# Altium project PX4FMUv2.3.PrjPcb
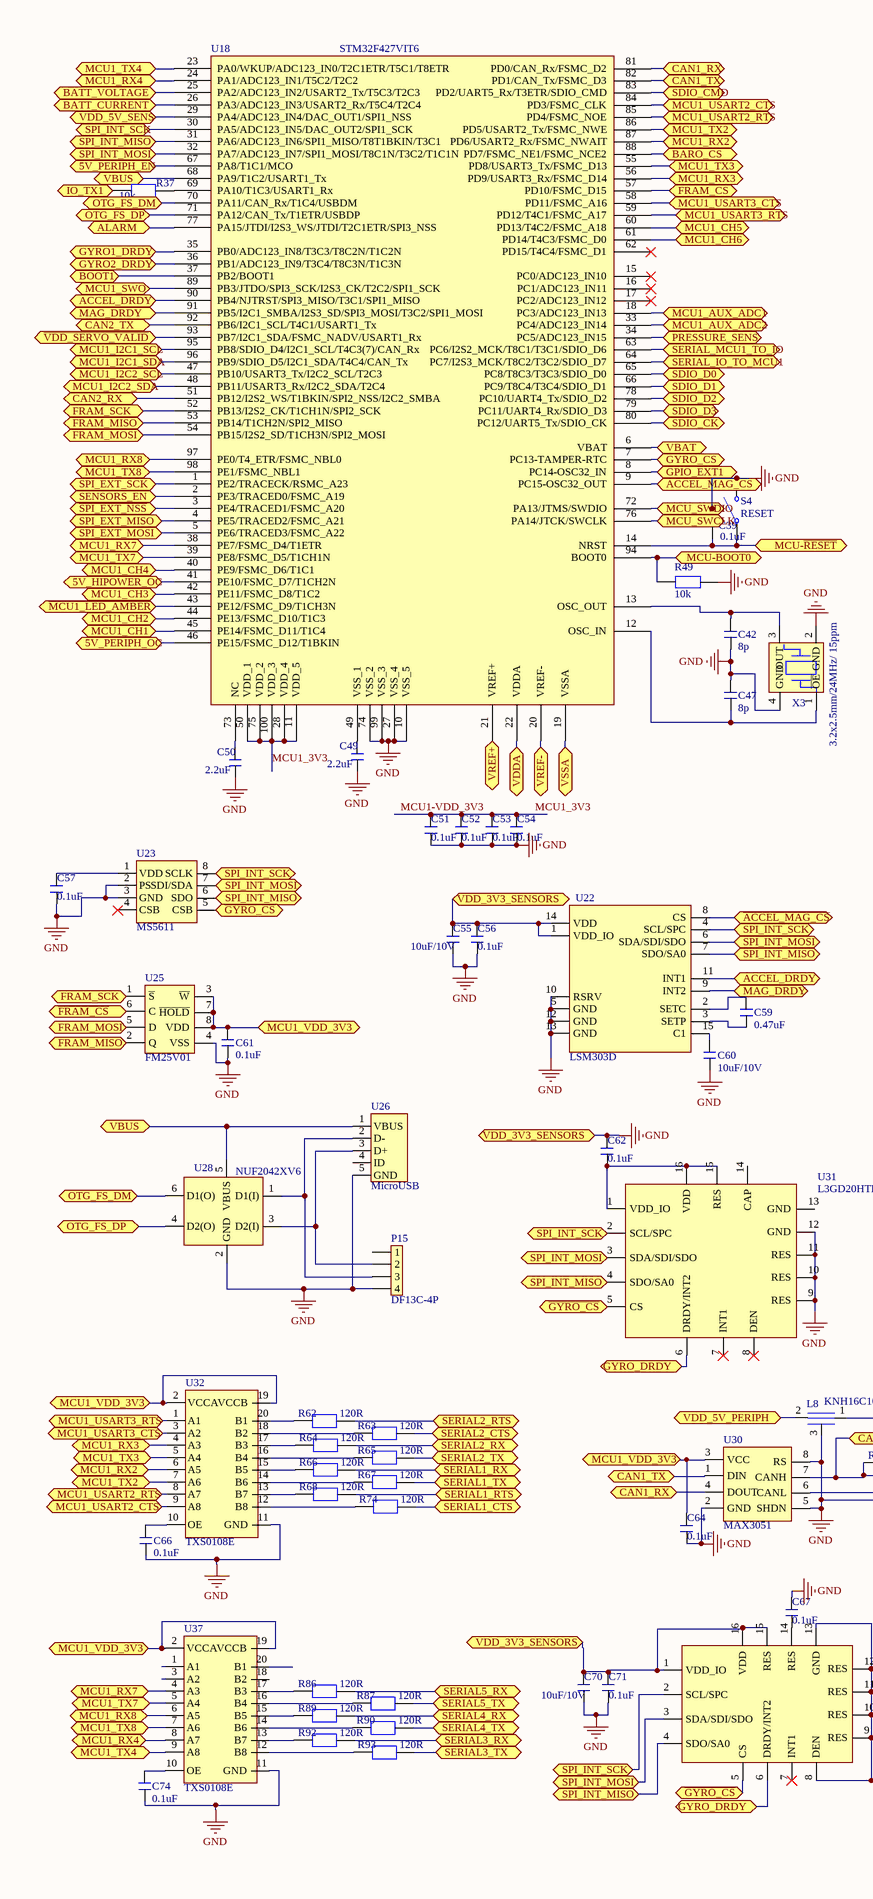
[diagram p0: PX4FMUV2.3_SCH_PROJECT.SchDoc, left]
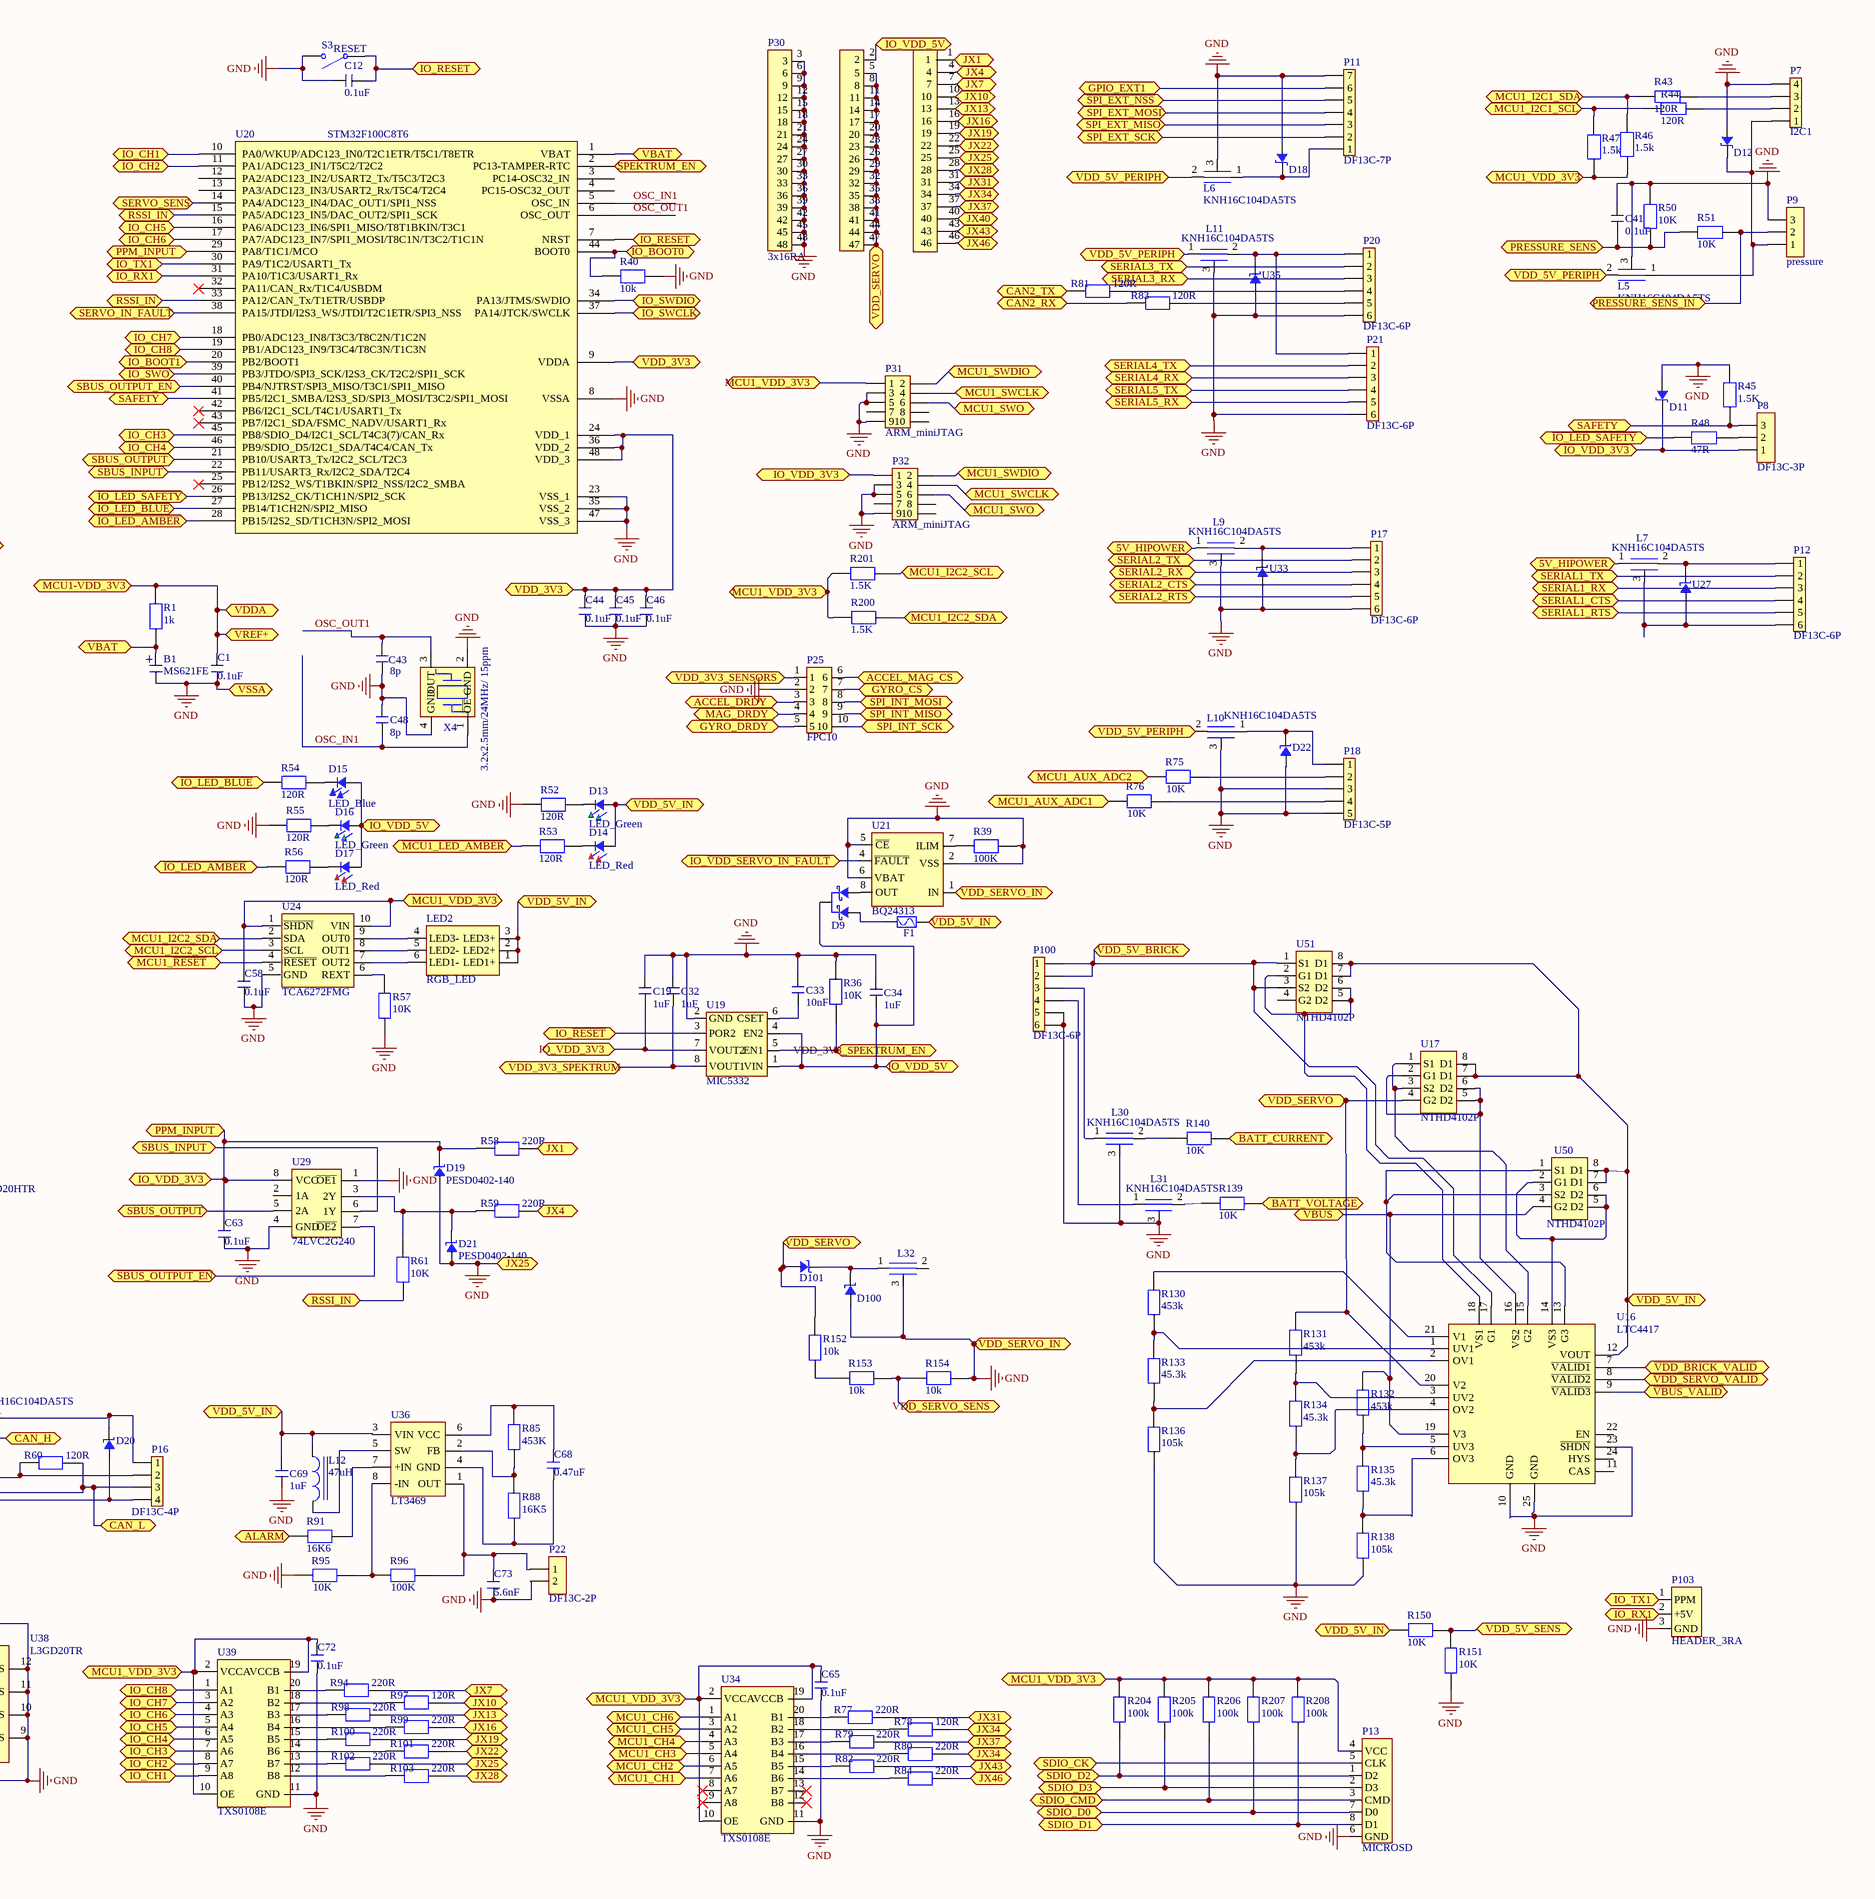
[diagram p1: PX4FMUV2.3_SCH_PROJECT.SchDoc, right]
1 sheet, 203 parts. Net scope: flat (ports and power ports of the same name join across sheets).

## Sheet PX4FMUV2.3_SCH_PROJECT.SchDoc
size A2

### Parts
B1  MS621FE  [MS621FE]
C1  0.1uF  [C 0402]
C12  0.1uF  [C 0402]
C19  1uF  [C 0603_L]
C32  1uF  [C 0603_L]
C33  10nF  [C 0402]
C34  1uF  [C 0603_L]
C39  0.1uF  [C 0402]
C41  0.1uF  [C 0402]
C42  8p  [C 0402]
C43  8p  [C 0402]
C44  0.1uF  [C 0402]
C45  0.1uF  [C 0402]
C46  0.1uF  [C 0402]
C47  8p  [C 0402]
C48  8p  [C 0402]
C49  2.2uF  [C 0603_L]
C50  2.2uF  [C 0603_L]
C51  0.1uF  [C 0402]
C52  0.1uF  [C 0402]
C53  0.1uF  [C 0402]
C54  0.1uF  [C 0402]
C55  10uF/10V  [C 0805_L]
C56  0.1uF  [C 0402]
C57  0.1uF  [C 0402]
C58  0.1uF  [C 0402]
C59  0.47uF  [C 0402]
C60  10uF/10V  [C 0805_L]
C61  0.1uF  [C 0402]
C62  0.1uF  [C 0402]
C63  0.1uF  [C 0402]
C64  0.1uF  [C 0402]
C65  0.1uF  [C 0402]
C66  0.1uF  [C 0402]
C67  0.1uF  [C 0402]
C68  0.47uF  [C 0402]
C69  1uF  [C 0603_L]
C70  10uF/10V  [C 0805_L]
C71  0.1uF  [C 0402]
C72  0.1uF  [C 0402]
C73  5.6nF  [C 0402]
C74  0.1uF  [C 0402]
D9  PMEG2005CT  [SOT23]  (value not drawn)
D11  PESD0402-140  [0402-TVS]  (value not drawn)
D12  PESD0402-140  [0402-TVS]  (value not drawn)
D13  LED_Green  [LED 0603G]
D14  LED_Red  [LED 0603R]
D15  LED_Blue  [LED 0603B]
D16  LED_Green  [LED 0603G]
D17  LED_Red  [LED 0603R]
D18  PESD0402-140  [0402-TVS]  (value not drawn)
D19  PESD0402-140  [0402-TVS]
D20  PESD0402-140  [0402-TVS]  (value not drawn)
D21  PESD0402-140  [0402-TVS]
D22  PESD0402-140  [0402-TVS]  (value not drawn)
D100  PESD0402-140  [0402-TVS]  (value not drawn)
D101  PESD0402-140  [0402-TVS]  (value not drawn)
F1  0ZCA0035FF2G  [PTC-1206]  (value not drawn)
L5  KNH16C104DA5TS  [KYOCERA-KNH16-DA]
L6  KNH16C104DA5TS  [KYOCERA-KNH16-DA]
L7  KNH16C104DA5TS  [KYOCERA-KNH16-DA]
L8  KNH16C104DA5TS  [KYOCERA-KNH16-DA]
L9  KNH16C104DA5TS  [KYOCERA-KNH16-DA]
L10  KNH16C104DA5TS  [KYOCERA-KNH16-DA]
L11  KNH16C104DA5TS  [KYOCERA-KNH16-DA]
L12  47uH  [L 0805]
L30  KNH16C104DA5TS  [KYOCERA-KNH16-DA]
L31  KNH16C104DA5TS  [KYOCERA-KNH16-DA]
L32  KNH16C104DA5TS  [KYOCERA-KNH16-DA]  (value not drawn)
LED2  RGB_LED  [RGB_LED]
P7  I2C1  [MX 1.25-LS-4P]
P8  DF13C-3P  [MX 1.25-LS-3P]
P9  pressure  [MX 1.25-LS-3P]
P11  DF13C-7P  [MX 1.25-LS-7P]
P12  DF13C-6P  [MX 1.25-LS-6P]
P13  MICROSD  [microSD]
P15  DF13C-4P  [MX 1.25-LS-4P]
P16  DF13C-4P  [MX 1.25-LS-4P]
P17  DF13C-6P  [MX 1.25-LS-6P]
P18  DF13C-5P  [MX 1.25-LS-5P]
P20  DF13C-6P  [MX 1.25-LS-6P]
P21  DF13C-6P  [MX 1.25-LS-6P]
P22  DF13C-2P  [MX 1.25-LS-2P]
P25  FPC10  [FPC0.5 2H-WS-10P]
P30  3x16RA  [3x16RA]
P31  ARM_miniJTAG  [FTSH-105-01-XXX-DV-K]
P32  ARM_miniJTAG  [FTSH-105-01-XXX-DV-K]
P100  DF13C-6P  [MX 1.25-LS-6P]
P103  HEADER_3RA
R1  1k  [0402R]
R36  10K  [0402R]
R37  10k  [0402R]
R39  100K  [0402R]
R40  10k  [0402R]
R43  120R  [0402R]
R44  120R  [0402R]
R45  1.5K  [0402R]
R46  1.5k  [0402R]
R47  1.5k  [0402R]
R48  47R  [0402R]
R49  10k  [0402R]
R50  10K  [0402R]
R51  10K  [0402R]
R52  120R  [0402R]
R53  120R  [0402R]
R54  120R  [0402R]
R55  120R  [0402R]
R56  120R  [0402R]
R57  10K  [0402R]
R58  220R  [0402R]
R59  220R  [0402R]
R60  120R  [0402R]
R61  10K  [0402R]
R62  120R  [0402R]
R63  120R  [0402R]
R64  120R  [0402R]
R65  120R  [0402R]
R66  120R  [0402R]
R67  120R  [0402R]
R68  120R  [0402R]
R74  120R  [0402R]
R75  10K  [0402R]
R76  10K  [0402R]
R77  220R  [0402R]
R78  120R  [0402R]
R79  220R  [0402R]
R80  220R  [0402R]
R81  120R  [0402R]
R82  220R  [0402R]
R83  120R  [0402R]
R84  220R  [0402R]
R85  453K  [0402R]
R86  120R  [0402R]
R87  120R  [0402R]
R88  16K5  [0402R]
R89  120R  [0402R]
R90  120R  [0402R]
R91  16K6  [0402R]
R92  120R  [0402R]
R93  120R  [0402R]
R94  220R  [0402R]
R95  10K  [0402R]
R96  100K  [0402R]
R97  120R  [0402R]
R98  220R  [0402R]
R99  220R  [0402R]
R100  220R  [0402R]
R101  220R  [0402R]
R102  220R  [0402R]
R103  220R  [0402R]
R130  453k  [0402R]
R131  453k  [0402R]
R132  453k  [0402R]
R133  45.3k  [0402R]
R134  45.3k  [0402R]
R135  45.3k  [0402R]
R136  105k  [0402R]
R137  105k  [0402R]
R138  105k  [0402R]
R139  10K  [0402R]
R140  10K  [0402R]
R150  10K  [0402R]
R151  10K  [0402R]
R152  10k  [0402R]
R153  10k  [0402R]
R154  10k  [0402R]
R200  1.5K  [0402R]
R201  1.5K  [0402R]
R204  100k  [0402R]
R205  100k  [0402R]
R206  100k  [0402R]
R207  100k  [0402R]
R208  100k  [0402R]
S3  RESET  [EVQP7J01K]
S4  RESET  [EVQP7J01K]
U16  LTC4417  [MO-220]
U17  NTHD4102P  [1206-8]
U18  STM32F427VIT6  [LQPF_100]
U19  MIC5332  [QFN8]
U20  STM32F100C8T6  [LQFP_48]
U21  BQ24313  [QFN8]
U22  LSM303D  [LGA_16L]
U23  MS5611  [MS5611]
U24  TCA6272FMG  [SON10]
U25  FM25V01  [SOIC8]
U26  MicroUSB  [USB-MICRO_E]
U27  PESD0402-140  [0402-TVS]  (value not drawn)
U28  NUF2042XV6  [SOT563-6]
U29  74LVC2G240  [TSSOP-8]
U30  MAX3051  [SOT23-8]
U31  L3GD20HTR  [LGA_16L]
U32  TXS0108E  [PQFN50P450X350X100_HS-21N]
U33  PESD0402-140  [0402-TVS]  (value not drawn)
U34  TXS0108E  [PQFN50P450X350X100_HS-21N]
U35  PESD0402-140  [0402-TVS]  (value not drawn)
U36  LT3469  [SOT23-8]
U37  TXS0108E  [PQFN50P450X350X100_HS-21N]
U38  L3GD20TR  [LGA-16]
U39  TXS0108E  [PQFN50P450X350X100_HS-21N]
U50  NTHD4102P  [1206-8]
U51  NTHD4102P  [1206-8]
X3  3.2x2.5mm/24MHz/ 15ppm  [OSC 3225-4P]
X4  3.2x2.5mm/24MHz/ 15ppm  [OSC 3225-4P]

### Ports
5V_HIPOWER (bidir), 5V_HIPOWER_OC (bidir), 5V_PERIPH_EN (bidir), 5V_PERIPH_OC (bidir), ACCEL_DRDY (bidir), ACCEL_MAG_CS (bidir), ALARM (bidir), BARO_CS (bidir), BATT_CURRENT (bidir), BATT_VOLTAGE (bidir), BOOT1 (bidir), CAN1_RX (bidir), CAN1_TX (bidir), CAN2_RX (bidir), CAN2_TX (bidir), CAN_H (bidir), CAN_L (bidir), FRAM_CS (bidir), FRAM_MISO (bidir), FRAM_MOSI (bidir), FRAM_SCK (bidir), GPIO_EXT1 (bidir), GYRO1_DRDY (bidir), GYRO2_DRDY (bidir), GYRO_CS (bidir), GYRO_DRDY (bidir), IO_BOOT0 (bidir), IO_BOOT1 (bidir), IO_CH1 (bidir), IO_CH2 (bidir), IO_CH3 (bidir), IO_CH4 (bidir), IO_CH5 (bidir), IO_CH6 (bidir), IO_CH7 (bidir), IO_CH8 (bidir), IO_RESET (bidir), IO_RX1 (bidir), IO_SWCLK (bidir), IO_SWDIO (bidir), IO_SWO (bidir), IO_TX1 (bidir), IO_VDD_3V3 (bidir), IO_VDD_5V (bidir), IO_~{RESET} (bidir), IO_~{VDD_SERVO_IN_FAULT} (bidir), JX1 (bidir), JX4 (bidir), JX7 (bidir), JX10 (bidir), JX13 (bidir), JX16 (bidir), JX19 (bidir), JX22 (bidir), JX25 (bidir), JX28 (bidir), JX31 (bidir), JX34 (bidir), JX37 (bidir), JX40 (bidir), JX43 (bidir), JX46 (bidir), MAG_DRDY (bidir), MCU1-VDD_3V3 (bidir), MCU1_AUX_ADC1 (bidir), MCU1_AUX_ADC2 (bidir), MCU1_CH1 (bidir), MCU1_CH2 (bidir), MCU1_CH3 (bidir), MCU1_CH4 (bidir), MCU1_CH5 (bidir), MCU1_CH6 (bidir), MCU1_I2C1_SCL (bidir), MCU1_I2C1_SDA (bidir), MCU1_I2C2_SCL (bidir), MCU1_I2C2_SDA (bidir), MCU1_RX2 (bidir), MCU1_RX3 (bidir), MCU1_RX4 (bidir), MCU1_RX7 (bidir), MCU1_RX8 (bidir), MCU1_SWCLK (bidir), MCU1_SWDIO (bidir), MCU1_SWO (bidir), MCU1_TX2 (bidir), MCU1_TX3 (bidir), MCU1_TX4 (bidir), MCU1_TX7 (bidir), MCU1_TX8 (bidir), MCU1_USART2_CTS (bidir), MCU1_USART2_RTS (bidir), MCU1_USART3_CTS (bidir), MCU1_USART3_RTS (bidir), MCU1_VDD_3V3 (bidir), MCU1_~{RESET} (bidir), MCU-BOOT0 (bidir), MCU-~{RESET} (bidir), MCU_SWCLK (bidir), MCU_SWDIO (bidir), OTG_FS_DM (bidir), OTG_FS_DP (bidir), PPM_INPUT (bidir), PRESSURE_SENS (bidir), PRESSURE_SENS_IN (bidir), RSSI_IN (bidir), SAFETY (bidir), SBUS_INPUT (bidir), SBUS_OUTPUT (bidir), SBUS_OUTPUT_EN (bidir), SDIO_CK (bidir), SDIO_CMD (bidir), SDIO_D0 (bidir), SDIO_D1 (bidir), SDIO_D2 (bidir), SDIO_D3 (bidir), SENSORS_EN (bidir), SERIAL1_CTS (bidir), SERIAL1_RTS (bidir), SERIAL1_RX (bidir), SERIAL1_TX (bidir), SERIAL2_CTS (bidir), SERIAL2_RTS (bidir), SERIAL2_RX (bidir), SERIAL2_TX (bidir), SERIAL3_RX (bidir), SERIAL3_TX (bidir), SERIAL4_RX (bidir), SERIAL4_TX (bidir), SERIAL5_RX (bidir), SERIAL5_TX (bidir), SERIAL_IO_TO_MCU1 (bidir), SERIAL_MCU1_TO_IO (bidir), SERVO_IN_FAULT (bidir), SERVO_SENS (bidir), SPEKTRUM_EN (bidir), SPI_EXT_MISO (bidir), SPI_EXT_MOSI (bidir), SPI_EXT_SCK (bidir), SPI_INT_MISO (bidir), SPI_INT_MOSI (bidir), SPI_INT_SCK (bidir), VBAT (bidir), VBUS (bidir), VDD_3V3 (bidir), VDD_3V3_SENSORS (bidir), VDD_3V3_SPEKTRUM (bidir), VDD_3V3_SPEKTRUM_EN (bidir), VDD_5V_BRICK (bidir), VDD_5V_IN (bidir), VDD_5V_PERIPH (bidir), VDD_5V_SENS (bidir), VDD_SERVO (bidir), VDD_SERVO_IN (bidir), VDD_SERVO_SENS (bidir), VDDA (bidir), VREF+ (bidir), VREF- (bidir), VSSA (bidir), ~{ACCEL_MAG_CS} (bidir), ~{FRAM_CS} (bidir), ~{GYRO_CS} (bidir), ~{IO_LED_AMBER} (bidir), ~{IO_LED_BLUE} (bidir), ~{IO_LED_SAFETY} (bidir), ~{MCU1_LED_AMBER} (bidir), ~{SBUS_OUTPUT_EN} (bidir), ~{SPI_EXT_NSS} (bidir), ~{VBUS_VALID} (bidir), ~{VDD_BRICK_VALID} (bidir), ~{VDD_SERVO_VALID} (bidir)

### Nets
GND: B1.2 C1.2 C12.2 C19.2 C32.2 C33.2 C34.2 C39.2 C41.2 C42.2 C43.2 C44.2 C45.2 C46.2 C47.1 C48.1 C49.2 C50.2 C51.2 C52.2 C53.2 C54.2 C55.1 C55.2 C56.1 C56.2 C57.2 C58.2 C60.2 C61.2 C62.1 C63.2 C64.2 C65.2 C66.2 C67.1 C69.2 C70.1 C70.2 C71.1 C71.2 C72.2 C73.2 C74.2 D11.1 D12.1 D18.1 D19.1 D20.1 D21.1 D22.1 D100.1 L5.3 L6.3 L8.3 L9.3 L10.3 L11.3 L30.3 L31.3 L32.3 P7.4 P9.3 P11.7 P13.6(GND) P15.4 P16.4 P17.6 P18.3 P18.5 P20.6 P21.6 P22.2 P25.1 P25.2 P30.3 P30.6 P30.9 P30.12 P30.15 P30.18 P30.21 P30.24 P30.25 P30.27 P30.30 P30.33 P30.36 P30.39 P30.42 P30.45 P30.48 P31.3 P31.5 P31.9 P32.3 P32.5 P32.9 P100.5 P100.6 P103.3(GND) R36.2 R39.2 R40.1 R45.2 R49.1 R50.2 R52.1 R55.1 R57.1 R95.2 R102.2 R136.1 R137.1 R138.1 R151.2 R154.1 S3.2 S4.2 U16.10(GND) U16.23(~{SHDN}) U16.25(GND) U18.10(VSS_5) U18.19(VSSA) U18.27(VSS_4) U18.74(VSS_2) U18.99(VSS_3) U19.2(GND) U20.8(VSSA) U20.23(VSS_1) U20.35(VSS_2) U20.47(VSS_3) U21.1(IN) U21.2(VSS) U21.5(~{CE}) U21.6(VBAT) U22.1(VDD_IO) U22.5(GND) U22.10(RSRV) U22.12(GND) U22.13(GND) U22.14(VDD) U23.2(PS) U23.3(GND) U24.5(GND) U25.4(VSS) U26.5(GND) U28.2(GND) U29.1(~{OE1}) U29.4(GND) U30.2(GND) U30.5(SHDN) U30.8(RS) U31.9(RES) U31.10(RES) U31.11(RES) U31.12(GND) U32.11(GND) U33.1 U34.11(GND) U35.1 U37.11(GND) U38.1(VDD_IO) U38.8(DEN) U38.9(RES) U38.10(RES) U38.11(RES) U38.12(RES) U38.13(GND) U38.15(RES) U38.16(VDD) U39.11(GND) X3.2(GND) X3.4(GND) X4.2(GND) X4.4(GND) ; port VSSA, port VDD_3V3_SENSORS, port JX25, port VDD_SERVO_IN
MCU1-VDD_3V3: C51.1 C52.1 C53.1 C54.1 U18.11(VDD_5) U18.28(VDD_4) U18.50(VDD_1) U18.75(VDD_2) U18.100(VDD_3)  [also labelled MCU1_3V3]
OSC_IN1: C48.2 U20.5(OSC_IN) X4.1(~{OE})
OSC_OUT1: C43.1 U20.6(OSC_OUT) X4.3(OUT)
NetB1_1: B1.1 R1.1 U18.6(VBAT) U20.1(VBAT) ; port VBAT
NetC1_1: C1.1 R1.2 U18.21(VREF+) U18.22(VDDA) ; port VDDA, port VREF+, port MCU1-VDD_3V3
NetC12_1: C12.1 S3.1 U20.7(NRST) ; port IO_RESET
NetC19_1: C19.1 C63.1 D11.2 D19.2 P8.1 P32.1 R58.1 U19.7(VOUT2) U20.29(PA8/T1C1/MCO) U29.8(VCC) ; port PPM_INPUT, port IO_VDD_3V3
NetC32_1: C32.1 U19.8(VOUT1) ; port VDD_3V3_SPEKTRUM
NetC33_1: C33.1 U19.6(CSET)
NetC34_1: C34.1 D9.3 D15.3 D16.3 D17.3 P30.2 U19.1(VIN) U19.4(EN2) ; port IO_VDD_5V
NetC39_1: C39.1 S4.1 U18.14(NRST) ; port MCU-~{RESET}
NetC41_1: C41.1 R50.1 R51.1 U18.34(PC5/ADC123_IN15) ; port PRESSURE_SENS
NetC42_1: C42.1 U18.13(OSC_OUT) X3.3(OUT)
NetC44_1: C44.1 C45.1 C46.1 U20.9(VDDA) U20.24(VDD_1) U20.36(VDD_2) U20.48(VDD_3) ; port VDD_3V3
NetC47_2: C47.2 U18.12(OSC_IN) X3.1(~{OE})
NetC49_1: C49.1 U18.49(VSS_1)
NetC50_1: C50.1 U18.73(NC)
NetC57_1: C57.1 U23.1(VDD)
NetC58_1: C58.1 C61.1 C64.1 C65.1 C72.1 P13.4(VCC) P31.1 R46.2 R47.2 R200.2 R201.2 R204.2 R205.2 R206.2 R207.2 R208.2 U24.1(~{SHDN}) U24.10(VIN) U25.3(~{W}) U25.7(~{HOLD}) U25.8(VDD) U30.3(VCC) U32.2(VCCA) U32.19(VCCB) U34.2(VCCA) U34.10(OE) U34.19(VCCB) U37.2(VCCA) U37.19(VCCB) U39.2(VCCA) U39.10(OE) U39.19(VCCB) ; port MCU1_VDD_3V3
NetC59_1: C59.1 U22.2(SETC)
NetC59_2: C59.2 U22.3(SETP)
NetC60_1: C60.1 U22.15(C1)
NetC62_2: C62.2 U31.1(VDD_IO) U31.15(RES) U31.16(VDD)
NetC66_1: C66.1 U32.10(OE)
NetC67_2: C67.2 U38.14(RES)
NetC68_1: C68.1 R85.2 U36.6(VCC)
NetC68_2: C68.2 R88.1 U36.4(GND)
NetC69_1: C69.1 D13.3 D14.3 F1.4 L12.2 LED2.1(LED1+) LED2.2(LED2+) LED2.3(LED3+) R150.2 U16.12(VOUT) U17.7(D1) U17.8(D1) U36.3(VIN) U50.7(D1) U50.8(D1) U51.7(D1) U51.8(D1) ; port VDD_5V_IN
NetC73_1: C73.1 P22.1 R96.1 U36.1(OUT)
NetC74_1: C74.1 U37.10(OE)
NetD9_1: D9.1 F1.5
NetD9_2: D9.2 U21.8(OUT)
NetD12_2: D12.2 L5.1 P7.1 P9.1
NetD13_4: D13.4 R52.2
NetD14_4: D14.4 R53.1
NetD15_4: D15.4 R54.2
NetD16_4: D16.4 R55.2
NetD17_4: D17.4 R56.1
NetD18_2: D18.2 L6.1 P11.1
NetD20_2: D20.2 L8.1 P16.1
NetD21_2: D21.2 R59.1 R61.2 U29.3(2Y)
NetD22_2: D22.2 L10.1 P18.1
NetD100_2: D100.2 D101.2 L32.1
NetD101_1: D101.1 P30.5 P30.8 P30.11 P30.14 P30.17 P30.20 P30.23 P30.26 P30.29 P30.32 P30.35 P30.38 P30.41 P30.44 P30.47 R131.2 R152.2 U16.20(V2) U17.4(G2) ; port VDD_SERVO
NetL5_2: L5.2 L6.2 L8.2 L10.2 L11.1 ; port VDD_5V_PERIPH
NetL7_1: L7.1 L9.1 ; port 5V_HIPOWER
NetL7_2: L7.2 P12.1 U27.2
NetL7_3: L7.3 P12.6 U27.1
NetL9_2: L9.2 P17.1 U33.2
NetL11_2: L11.2 P20.1 P21.1 U35.2
NetL12_1: L12.1 U36.5(SW)
NetL30_1: L30.1 P100.3
NetL30_2: L30.2 R140.2
NetL31_1: L31.1 P100.4
NetL31_2: L31.2 R139.2
NetLED2_4: LED2.4(LED3-) U24.9(OUT0)
NetLED2_5: LED2.5(LED2-) U24.8(OUT1)
NetLED2_6: LED2.6(LED1-) U24.7(OUT2)
NetP7_2: P7.2 R44.1
NetP7_3: P7.3 R43.1
NetP8_2: P8.2 R48.1
NetP8_3: P8.3 R45.1 U20.41(PB5/I2C1_SMBA/I2S3_SD/SPI3_MOSI/T3C2/SPI1_MOSI) ; port SAFETY
NetP9_2: P9.2 R51.2 ; port PRESSURE_SENS_IN
NetP11_2: P11.2 U18.1(PE2/TRACECK/RSMC_A23) ; port SPI_EXT_SCK
NetP11_3: P11.3 U18.4(PE5/TRACED2/FSMC_A21) ; port SPI_EXT_MISO
NetP11_4: P11.4 U18.5(PE6/TRACED3/FSMC_A22) ; port SPI_EXT_MOSI
NetP11_5: P11.5 U18.3(PE4/TRACED1/FSMC_A20) ; port ~{SPI_EXT_NSS}
NetP11_6: P11.6 U18.8(PC14-OSC32_IN) ; port GPIO_EXT1
NetP12_2: P12.2 R67.2 ; port SERIAL1_TX
NetP12_3: P12.3 R66.2 ; port SERIAL1_RX
NetP12_4: P12.4 R74.2 ; port SERIAL1_CTS
NetP12_5: P12.5 R68.2 ; port SERIAL1_RTS
NetP13_1: P13.1(D2) R204.1 U18.78(PC10/UART4_Tx/SDIO_D2) ; port SDIO_D2
NetP13_2: P13.2(D3) R205.1 U18.79(PC11/UART4_Rx/SDIO_D3) ; port SDIO_D3
NetP13_3: P13.3(CMD) R206.1 U18.83(PD2/UART5_Rx/T3ETR/SDIO_CMD) ; port SDIO_CMD
NetP13_5: P13.5(CLK) U18.80(PC12/UART5_Tx/SDIO_CK) ; port SDIO_CK
NetP13_7: P13.7(D0) R207.1 U18.65(PC8/T8C3/T3C3/SDIO_D0) ; port SDIO_D0
NetP13_8: P13.8(D1) R208.1 U18.66(PC9/T8C4/T3C4/SDIO_D1) ; port SDIO_D1
NetP15_2: P15.2 U26.3(D+) U28.3(D2(I))
NetP15_3: P15.3 U26.2(D-) U28.1(D1(I))
NetP16_2: P16.2 R60.1 U30.7(CANH) ; port CAN_H
NetP16_3: P16.3 R60.2 U30.6(CANL) ; port CAN_L
NetP17_2: P17.2 R65.2 ; port SERIAL2_TX
NetP17_3: P17.3 R64.2 ; port SERIAL2_RX
NetP17_4: P17.4 R63.2 ; port SERIAL2_CTS
NetP17_5: P17.5 R62.2 ; port SERIAL2_RTS
NetP18_2: P18.2 R75.1
NetP18_4: P18.4 R76.1
NetP20_2: P20.2 R93.2 ; port SERIAL3_TX
NetP20_3: P20.3 R92.2 ; port SERIAL3_RX
NetP20_4: P20.4 R81.2
NetP20_5: P20.5 R83.2
NetP21_2: P21.2 R90.2 ; port SERIAL4_TX
NetP21_3: P21.3 R89.2 ; port SERIAL4_RX
NetP21_4: P21.4 R87.2 ; port SERIAL5_TX
NetP21_5: P21.5 R86.2 ; port SERIAL5_RX
NetP25_3: P25.3 U18.90(PB4/NJTRST/SPI3_MISO/T3C1/SPI1_MISO) U22.11(INT1) ; port ACCEL_DRDY
NetP25_4: P25.4 U18.91(PB5/I2C1_SMBA/I2S3_SD/SPI3_MOSI/T3C2/SPI1_MOSI) U22.9(INT2) ; port MAG_DRDY
NetP25_5: P25.5 U31.6(DRDY/INT2) U38.6(DRDY/INT2) ; port GYRO_DRDY
NetP25_6: P25.6 U18.9(PC15-OSC32_OUT) ; port ACCEL_MAG_CS
NetP25_7: P25.7 U18.7(PC13-TAMPER-RTC) ; port GYRO_CS
NetP25_8: P25.8 U18.32(PA7/ADC123_IN7/SPI1_MOSI/T8C1N/T3C2/T1C1N) U22.6(SDA/SDI/SDO) U23.7(SDI/SDA) U31.3(SDA/SDI/SDO) U38.3(SDA/SDI/SDO) ; port SPI_INT_MOSI
NetP25_9: P25.9 U18.31(PA6/ADC123_IN6/SPI1_MISO/T8T1BKIN/T3C1) U22.7(SDO/SA0) U23.6(SDO) U31.4(SDO/SA0) U38.4(SDO/SA0) ; port SPI_INT_MISO
NetP25_10: P25.10 U18.30(PA5/ADC123_IN5/DAC_OUT2/SPI1_SCK) U22.4(SCL/SPC) U23.8(SCLK) U31.2(SCL/SPC) U38.2(SCL/SPC) ; port SPI_INT_SCK
NetP30_1: P30.1 R58.2 ; port JX1
NetP30_4: P30.4 R59.2 ; port JX4
NetP30_7: P30.7 R94.2 ; port JX7
NetP30_10: P30.10 R97.2 ; port JX10
NetP30_13: P30.13 R98.2 ; port JX13
NetP30_16: P30.16 R99.2 ; port JX16
NetP30_19: P30.19 R100.2 ; port JX19
NetP30_22: P30.22 R101.2 ; port JX22
NetP30_28: P30.28 R103.2 ; port JX28
NetP30_31: P30.31 R77.2 ; port JX31
NetP30_34: P30.34 R78.2 R80.2 ; port JX34
NetP30_37: P30.37 R79.2 ; port JX37
NetP30_40: P30.40 ; port JX40
NetP30_43: P30.43 R82.2 ; port JX43
NetP30_46: P30.46 R84.2 ; port JX46
NetP31_2: P31.2 P32.2 ; port MCU1_SWDIO
NetP31_4: P31.4 P32.4 ; port MCU1_SWCLK
NetP31_6: P31.6 P32.6 U18.89(PB3/JTDO/SPI3_SCK/I2S3_CK/T2C2/SPI1_SCK) ; port MCU1_SWO
NetP100_1: P100.1 P100.2 U16.17(G1) U51.1(S1) U51.3(S2) ; port VDD_5V_BRICK
NetP103_1: P103.1(PPM) R37.1 U20.30(PA9/T1C2/USART1_Tx) ; port IO_TX1
NetP103_2: P103.2(+5V) U20.31(PA10/T1C3/USART1_Rx) ; port IO_RX1
NetR36_1: R36.1 U19.5(EN1) ; port VDD_3V3_SPEKTRUM_EN
NetR37_2: R37.2 U18.69(PA10/T1C3/USART1_Rx)
NetR39_1: R39.1 U21.7(ILIM)
NetR40_2: R40.2 U20.44(BOOT0) ; port IO_BOOT0
NetR43_2: R43.2 R46.1 U18.96(PB9/SDIO_D5/I2C1_SDA/T4C4/CAN_Tx) ; port MCU1_I2C1_SDA
NetR44_2: R44.2 R47.1 U18.95(PB8/SDIO_D4/I2C1_SCL/T4C3(7)/CAN_Rx) ; port MCU1_I2C1_SCL
NetR48_2: R48.2 U20.26(PB13/I2S2_CK/T1CH1N/SPI2_SCK) ; port ~{IO_LED_SAFETY}
NetR49_2: R49.2 U18.94(BOOT0) ; port MCU-BOOT0
NetR53_2: R53.2 U18.43(PE12/FSMC_D9/T1CH3N) ; port ~{MCU1_LED_AMBER}
NetR54_1: R54.1 U20.27(PB14/T1CH2N/SPI2_MISO) ; port ~{IO_LED_BLUE}
NetR56_2: R56.2 U20.28(PB15/I2S2_SD/T1CH3N/SPI2_MOSI) ; port ~{IO_LED_AMBER}
NetR57_2: R57.2 U24.6(REXT)
NetR61_1: R61.1 U20.15(PA5/ADC123_IN5/DAC_OUT2/SPI1_SCK) U20.33(PA12/CAN_Tx/T1ETR/USBDP) ; port RSSI_IN
NetR62_1: R62.1 U32.20(B1)
NetR63_1: R63.1 U32.18(B2)
NetR64_1: R64.1 U32.17(B3)
NetR65_1: R65.1 U32.16(B4)
NetR66_1: R66.1 U32.15(B5)
NetR67_1: R67.1 U32.14(B6)
NetR68_1: R68.1 U32.13(B7)
NetR74_1: R74.1 U32.12(B8)
NetR75_2: R75.2 U18.33(PC4/ADC123_IN14) ; port MCU1_AUX_ADC2
NetR76_2: R76.2 U18.18(PC3/ADC123_IN13) ; port MCU1_AUX_ADC1
NetR77_1: R77.1 U34.20(B1)
NetR78_1: R78.1 U34.18(B2)
NetR79_1: R79.1 U34.17(B3)
NetR80_1: R80.1 U34.16(B4)
NetR81_1: R81.1 U18.92(PB6/I2C1_SCL/T4C1/USART1_Tx) ; port CAN2_TX
NetR82_1: R82.1 U34.15(B5)
NetR83_1: R83.1 U18.51(PB12/I2S2_WS/T1BKIN/SPI2_NSS/I2C2_SMBA) ; port CAN2_RX
NetR84_1: R84.1 U34.14(B6)
NetR85_1: R85.1 R88.2 U36.2(FB)
NetR86_1: R86.1 U37.17(B3)
NetR87_1: R87.1 U37.16(B4)
NetR89_1: R89.1 U37.15(B5)
NetR90_1: R90.1 U37.14(B6)
NetR91_1: R91.1 U36.7(+IN)
NetR91_2: R91.2 U18.77(PA15/JTDI/I2S3_WS/JTDI/T2C1ETR/SPI3_NSS) ; port ALARM
NetR92_1: R92.1 U37.13(B7)
NetR93_1: R93.1 U37.12(B8)
NetR94_1: R94.1 U39.20(B1)
NetR95_1: R95.1 R96.2 U36.8(-IN)
NetR97_1: R97.1 U39.18(B2)
NetR98_1: R98.1 U39.17(B3)
NetR99_1: R99.1 U39.16(B4)
NetR100_1: R100.1 U39.15(B5)
NetR101_1: R101.1 U39.14(B6)
NetR102_1: R102.1 U39.13(B7)
NetR103_1: R103.1 U39.12(B8)
NetR130_1: R130.1 R133.2 U16.1(UV1)
NetR130_2: R130.2 U16.21(V1)
NetR131_1: R131.1 R134.2 U16.3(UV2)
NetR132_1: R132.1 R135.2 U16.5(UV3)
NetR132_2: R132.2 U16.19(V3) U18.68(PA9/T1C2/USART1_Tx) U26.1(VBUS) U28.5(VBUS) U50.4(G2) ; port VBUS
NetR133_1: R133.1 R136.2 U16.2(OV1)
NetR134_1: R134.1 R137.2 U16.4(OV2)
NetR135_1: R135.1 R138.2 U16.6(OV3)
NetR139_1: R139.1 U18.25(PA2/ADC123_IN2/USART2_Tx/T5C3/T2C3) ; port BATT_VOLTAGE
NetR140_1: R140.1 U18.26(PA3/ADC123_IN3/USART2_Rx/T5C4/T2C4) ; port BATT_CURRENT
NetR150_1: R150.1 R151.1 U18.29(PA4/ADC123_IN4/DAC_OUT1/SPI1_NSS) ; port VDD_5V_SENS
NetR152_1: R152.1 R153.2
NetR153_1: R153.1 R154.2 ; port VDD_SERVO_SENS
NetR200_1: R200.1 U18.48(PB11/USART3_Rx/I2C2_SDA/T2C4) U24.2(SDA) ; port MCU1_I2C2_SDA
NetR201_1: R201.1 U18.47(PB10/USART3_Tx/I2C2_SCL/T2C3) U24.3(SCL) ; port MCU1_I2C2_SCL
NetU16_7: U16.7(~{VALID1}) ; port ~{VDD_BRICK_VALID}
NetU16_8: U16.8(~{VALID2}) U18.93(PB7/I2C1_SDA/FSMC_NADV/USART1_Rx) ; port ~{VDD_SERVO_VALID}
NetU16_9: U16.9(~{VALID3}) ; port ~{VBUS_VALID}
NetU16_13: U16.13(G3) U50.1(S1) U50.3(S2)
NetU16_14: U16.14(VS3) U50.2(G1) U50.5(D2) U50.6(D2)
NetU16_15: U16.15(G2) U17.1(S1) U17.3(S2)
NetU16_16: U16.16(VS2) U17.2(G1) U17.5(D2) U17.6(D2)
NetU16_18: U16.18(VS1) U51.2(G1) U51.5(D2) U51.6(D2)
NetU18_2: U18.2(PE3/TRACED0/FSMC_A19) ; port SENSORS_EN
NetU18_20: U18.20(VREF-) ; port VREF-
NetU18_23: U18.23(PA0/WKUP/ADC123_IN0/T2C1ETR/T5C1/T8ETR) U37.9(A8) ; port MCU1_TX4
NetU18_24: U18.24(PA1/ADC123_IN1/T5C2/T2C2) U37.8(A7) ; port MCU1_RX4
NetU18_35: U18.35(PB0/ADC123_IN8/T3C3/T8C2N/T1C2N) ; port GYRO1_DRDY
NetU18_36: U18.36(PB1/ADC123_IN9/T3C4/T8C3N/T1C3N) ; port GYRO2_DRDY
NetU18_37: U18.37(PB2/BOOT1) ; port BOOT1
NetU18_38: U18.38(PE7/FSMC_D4/T1ETR) U37.4(A3) ; port MCU1_RX7
NetU18_39: U18.39(PE8/FSMC_D5/T1CH1N) U37.5(A4) ; port MCU1_TX7
NetU18_40: U18.40(PE9/FSMC_D6/T1C1) U34.4(A3) ; port MCU1_CH4
NetU18_41: U18.41(PE10/FSMC_D7/T1CH2N) ; port 5V_HIPOWER_OC
NetU18_42: U18.42(PE11/FSMC_D8/T1C2) U34.5(A4) ; port MCU1_CH3
NetU18_44: U18.44(PE13/FSMC_D10/T1C3) U34.6(A5) ; port MCU1_CH2
NetU18_45: U18.45(PE14/FSMC_D11/T1C4) U34.7(A6) ; port MCU1_CH1
NetU18_46: U18.46(PE15/FSMC_D12/T1BKIN) ; port 5V_PERIPH_OC
NetU18_52: U18.52(PB13/I2S2_CK/T1CH1N/SPI2_SCK) U25.1(~{S}) ; port FRAM_SCK
NetU18_53: U18.53(PB14/T1CH2N/SPI2_MISO) U25.2(Q) ; port FRAM_MISO
NetU18_54: U18.54(PB15/I2S2_SD/T1CH3N/SPI2_MOSI) U25.5(D) ; port FRAM_MOSI
NetU18_55: U18.55(PD8/USART3_Tx/FSMC_D13) U32.5(A4) ; port MCU1_TX3
NetU18_56: U18.56(PD9/USART3_Rx/FSMC_D14) U32.4(A3) ; port MCU1_RX3
NetU18_57: U18.57(PD10/FSMC_D15) ; port FRAM_CS
NetU18_58: U18.58(PD11/FSMC_A16) U32.3(A2) ; port MCU1_USART3_CTS
NetU18_59: U18.59(PD12/T4C1/FSMC_A17) U32.1(A1) ; port MCU1_USART3_RTS
NetU18_60: U18.60(PD13/T4C2/FSMC_A18) U34.3(A2) ; port MCU1_CH5
NetU18_61: U18.61(PD14/T4C3/FSMC_D0) U34.1(A1) ; port MCU1_CH6
NetU18_63: U18.63(PC6/I2S2_MCK/T8C1/T3C1/SDIO_D6) ; port SERIAL_MCU1_TO_IO
NetU18_64: U18.64(PC7/I2S3_MCK/T8C2/T3C2/SDIO_D7) ; port SERIAL_IO_TO_MCU1
NetU18_67: U18.67(PA8/T1C1/MCO) ; port 5V_PERIPH_EN
NetU18_70: U18.70(PA11/CAN_Rx/T1C4/USBDM) U28.6(D1(O)) ; port OTG_FS_DM
NetU18_71: U18.71(PA12/CAN_Tx/T1ETR/USBDP) U28.4(D2(O)) ; port OTG_FS_DP
NetU18_72: U18.72(PA13/JTMS/SWDIO) ; port MCU_SWDIO
NetU18_76: U18.76(PA14/JTCK/SWCLK) ; port MCU_SWCLK
NetU18_81: U18.81(PD0/CAN_Rx/FSMC_D2) U30.4(DOUT) ; port CAN1_RX
NetU18_82: U18.82(PD1/CAN_Tx/FSMC_D3) U30.1(DIN) ; port CAN1_TX
NetU18_84: U18.84(PD3/FSMC_CLK) U32.9(A8) ; port MCU1_USART2_CTS
NetU18_85: U18.85(PD4/FSMC_NOE) U32.8(A7) ; port MCU1_USART2_RTS
NetU18_86: U18.86(PD5/USART2_Tx/FSMC_NWE) U32.7(A6) ; port MCU1_TX2
NetU18_87: U18.87(PD6/USART2_Rx/FSMC_NWAIT) U32.6(A5) ; port MCU1_RX2
NetU18_88: U18.88(PD7/FSMC_NE1/FSMC_NCE2) ; port BARO_CS
NetU18_97: U18.97(PE0/T4_ETR/FSMC_NBL0) U37.6(A5) ; port MCU1_RX8
NetU18_98: U18.98(PE1/FSMC_NBL1) U37.7(A6) ; port MCU1_TX8
NetU19_3: U19.3(POR2) ; port IO_~{RESET}
NetU20_2: U20.2(PC13-TAMPER-RTC) ; port SPEKTRUM_EN
NetU20_10: U20.10(PA0/WKUP/ADC123_IN0/T2C1ETR/T5C1/T8ETR) U39.9(A8) ; port IO_CH1
NetU20_11: U20.11(PA1/ADC123_IN1/T5C2/T2C2) U39.8(A7) ; port IO_CH2
NetU20_14: U20.14(PA4/ADC123_IN4/DAC_OUT1/SPI1_NSS) ; port SERVO_SENS
NetU20_16: U20.16(PA6/ADC123_IN6/SPI1_MISO/T8T1BKIN/T3C1) U39.5(A4) ; port IO_CH5
NetU20_17: U20.17(PA7/ADC123_IN7/SPI1_MOSI/T8C1N/T3C2/T1C1N) U39.4(A3) ; port IO_CH6
NetU20_18: U20.18(PB0/ADC123_IN8/T3C3/T8C2N/T1C2N) U39.3(A2) ; port IO_CH7
NetU20_19: U20.19(PB1/ADC123_IN9/T3C4/T8C3N/T1C3N) U39.1(A1) ; port IO_CH8
NetU20_20: U20.20(PB2/BOOT1) ; port IO_BOOT1
NetU20_21: U20.21(PB10/USART3_Tx/I2C2_SCL/T2C3) U29.5(2A) ; port SBUS_OUTPUT
NetU20_22: U20.22(PB11/USART3_Rx/I2C2_SDA/T2C4) U29.6(1Y) ; port SBUS_INPUT
NetU20_34: U20.34(PA13/JTMS/SWDIO) ; port IO_SWDIO
NetU20_37: U20.37(PA14/JTCK/SWCLK) ; port IO_SWCLK
NetU20_38: U20.38(PA15/JTDI/I2S3_WS/JTDI/T2C1ETR/SPI3_NSS) ; port SERVO_IN_FAULT
NetU20_39: U20.39(PB3/JTDO/SPI3_SCK/I2S3_CK/T2C2/SPI1_SCK) ; port IO_SWO
NetU20_40: U20.40(PB4/NJTRST/SPI3_MISO/T3C1/SPI1_MISO) ; port SBUS_OUTPUT_EN
NetU20_45: U20.45(PB8/SDIO_D4/I2C1_SCL/T4C3(7)/CAN_Rx) U39.7(A6) ; port IO_CH3
NetU20_46: U20.46(PB9/SDIO_D5/I2C1_SDA/T4C4/CAN_Tx) U39.6(A5) ; port IO_CH4
NetU21_4: U21.4(~{FAULT}) ; port IO_~{VDD_SERVO_IN_FAULT}
NetU22_8: U22.8(CS) ; port ~{ACCEL_MAG_CS}
NetU23_5: U23.5(CSB) U31.5(CS) U38.5(CS) ; port ~{GYRO_CS}
NetU24_4: U24.4(~{RESET}) ; port MCU1_~{RESET}
NetU25_6: U25.6(C) ; port ~{FRAM_CS}
NetU29_7: U29.7(~{OE2}) ; port ~{SBUS_OUTPUT_EN}

Not connected (* = marked no-connect by the designer): L32 2; P15 1; P31 7 8 10; P32 7 8 10; U16 11(CAS) 22(EN) 24(HYS); U18 15(PC0/ADC123_IN10)* 16(PC1/ADC123_IN11)* 17(PC2/ADC123_IN12)* 62(PD15/T4C4/FSMC_D1)*; U20 3(PC14-OSC32_IN) 4(PC15-OSC32_OUT) 12(PA2/ADC123_IN2/USART2_Tx/T5C3/T2C3) 13(PA3/ADC123_IN3/USART2_Rx/T5C4/T2C4) 25(PB12/I2S2_WS/T1BKIN/SPI2_NSS/I2C2_SMBA)* 32(PA11/CAN_Rx/T1C4/USBDM)* 42(PB6/I2C1_SCL/T4C1/USART1_Tx)* 43(PB7/I2C1_SDA/FSMC_NADV/USART1_Rx)*; U23 4(CSB)*; U26 4(ID); U29 2(1A); U31 7(INT1)* 8(DEN)* 13(GND) 14(CAP); U34 8(A7)* 9(A8)* 12(B8)* 13(B7)*; U37 1(A1) 3(A2) 18(B2) 20(B1); U38 7(INT1)*; U51 4(G2)

### Library data of the parts
C1 C12 C33 C39 C41-C48 C51-C54 C56-C59 C61-C68 C71-C74 = CAP_0402
C19 C32 C34 C49 C50 C69 = CAP_0603
C55 C60 C70 = CAP_0805
L12 = L_0805
P7 = DF13C-4P
P9 = DF13C-3P
R1 R36 R37 R39 R40 R43-R68 R74-R103 R130-R140 R150-R154 R200 R201 R204-R208 = Res_0402
S3 S4 = SWITCH-MOMENTARY-2
U26 = MicroUSB_SMD
X3 X4 = OSCILLATOR